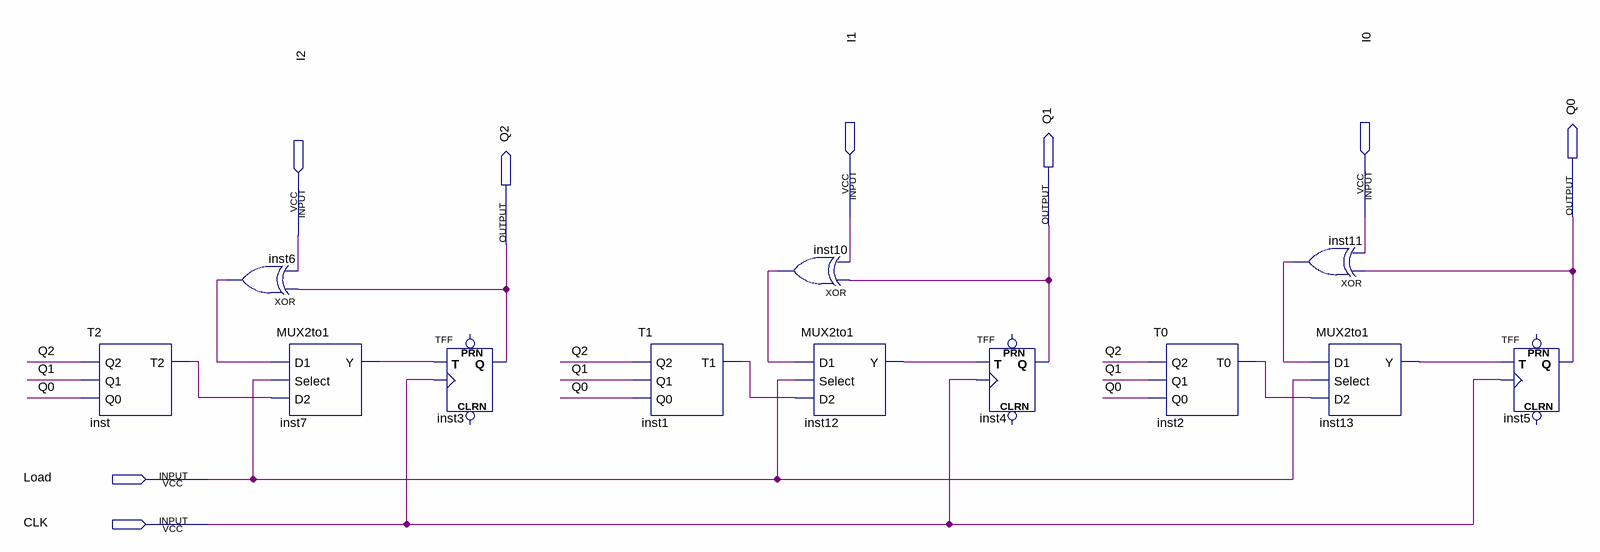
[diagram p0: schematic sheet]
// Quartus schematic BonusDesign.bdf as structural Verilog: 12 symbols, 8 pins
module BonusDesign (
  input  I1,
  input  I0,
  input  I2,
  input  Load,
  input  CLK,
  output Q0,
  output Q1,
  output Q2
);

  wire inst1_t1, inst2_t0, inst6_out, inst7_y, inst10_out, inst11_out, inst12_y, inst13_y, inst_t2;

  T2 inst (.Q2(Q2), .Q1(Q1), .Q0(Q0), .T2(inst_t2));
  xor inst6 (inst6_out, Q2, I2);
  MUX2to1 inst7 (.D1(inst6_out), .Select(Load), .D2(inst_t2), .Y(inst7_y));
  TFF inst3 (.T(inst7_y), .CLK(CLK), .Q(Q2));  // open: PRN, CLRN
  T1 inst1 (.Q2(Q2), .Q1(Q1), .Q0(Q0), .T1(inst1_t1));
  xor inst10 (inst10_out, Q1, I1);
  MUX2to1 inst12 (.D1(inst10_out), .Select(Load), .D2(inst1_t1), .Y(inst12_y));
  TFF inst4 (.T(inst12_y), .CLK(CLK), .Q(Q1));  // open: PRN, CLRN
  T0 inst2 (.Q2(Q2), .Q1(Q1), .Q0(Q0), .T0(inst2_t0));
  xor inst11 (inst11_out, Q0, I0);
  MUX2to1 inst13 (.D1(inst11_out), .Select(Load), .D2(inst2_t0), .Y(inst13_y));
  TFF inst5 (.T(inst13_y), .CLK(CLK), .Q(Q0));  // open: PRN, CLRN
endmodule
